# Altium schematic sheet HS-IO Outputs.SchDoc
size A3; SheetNumber: 2; SheetTotal: 3
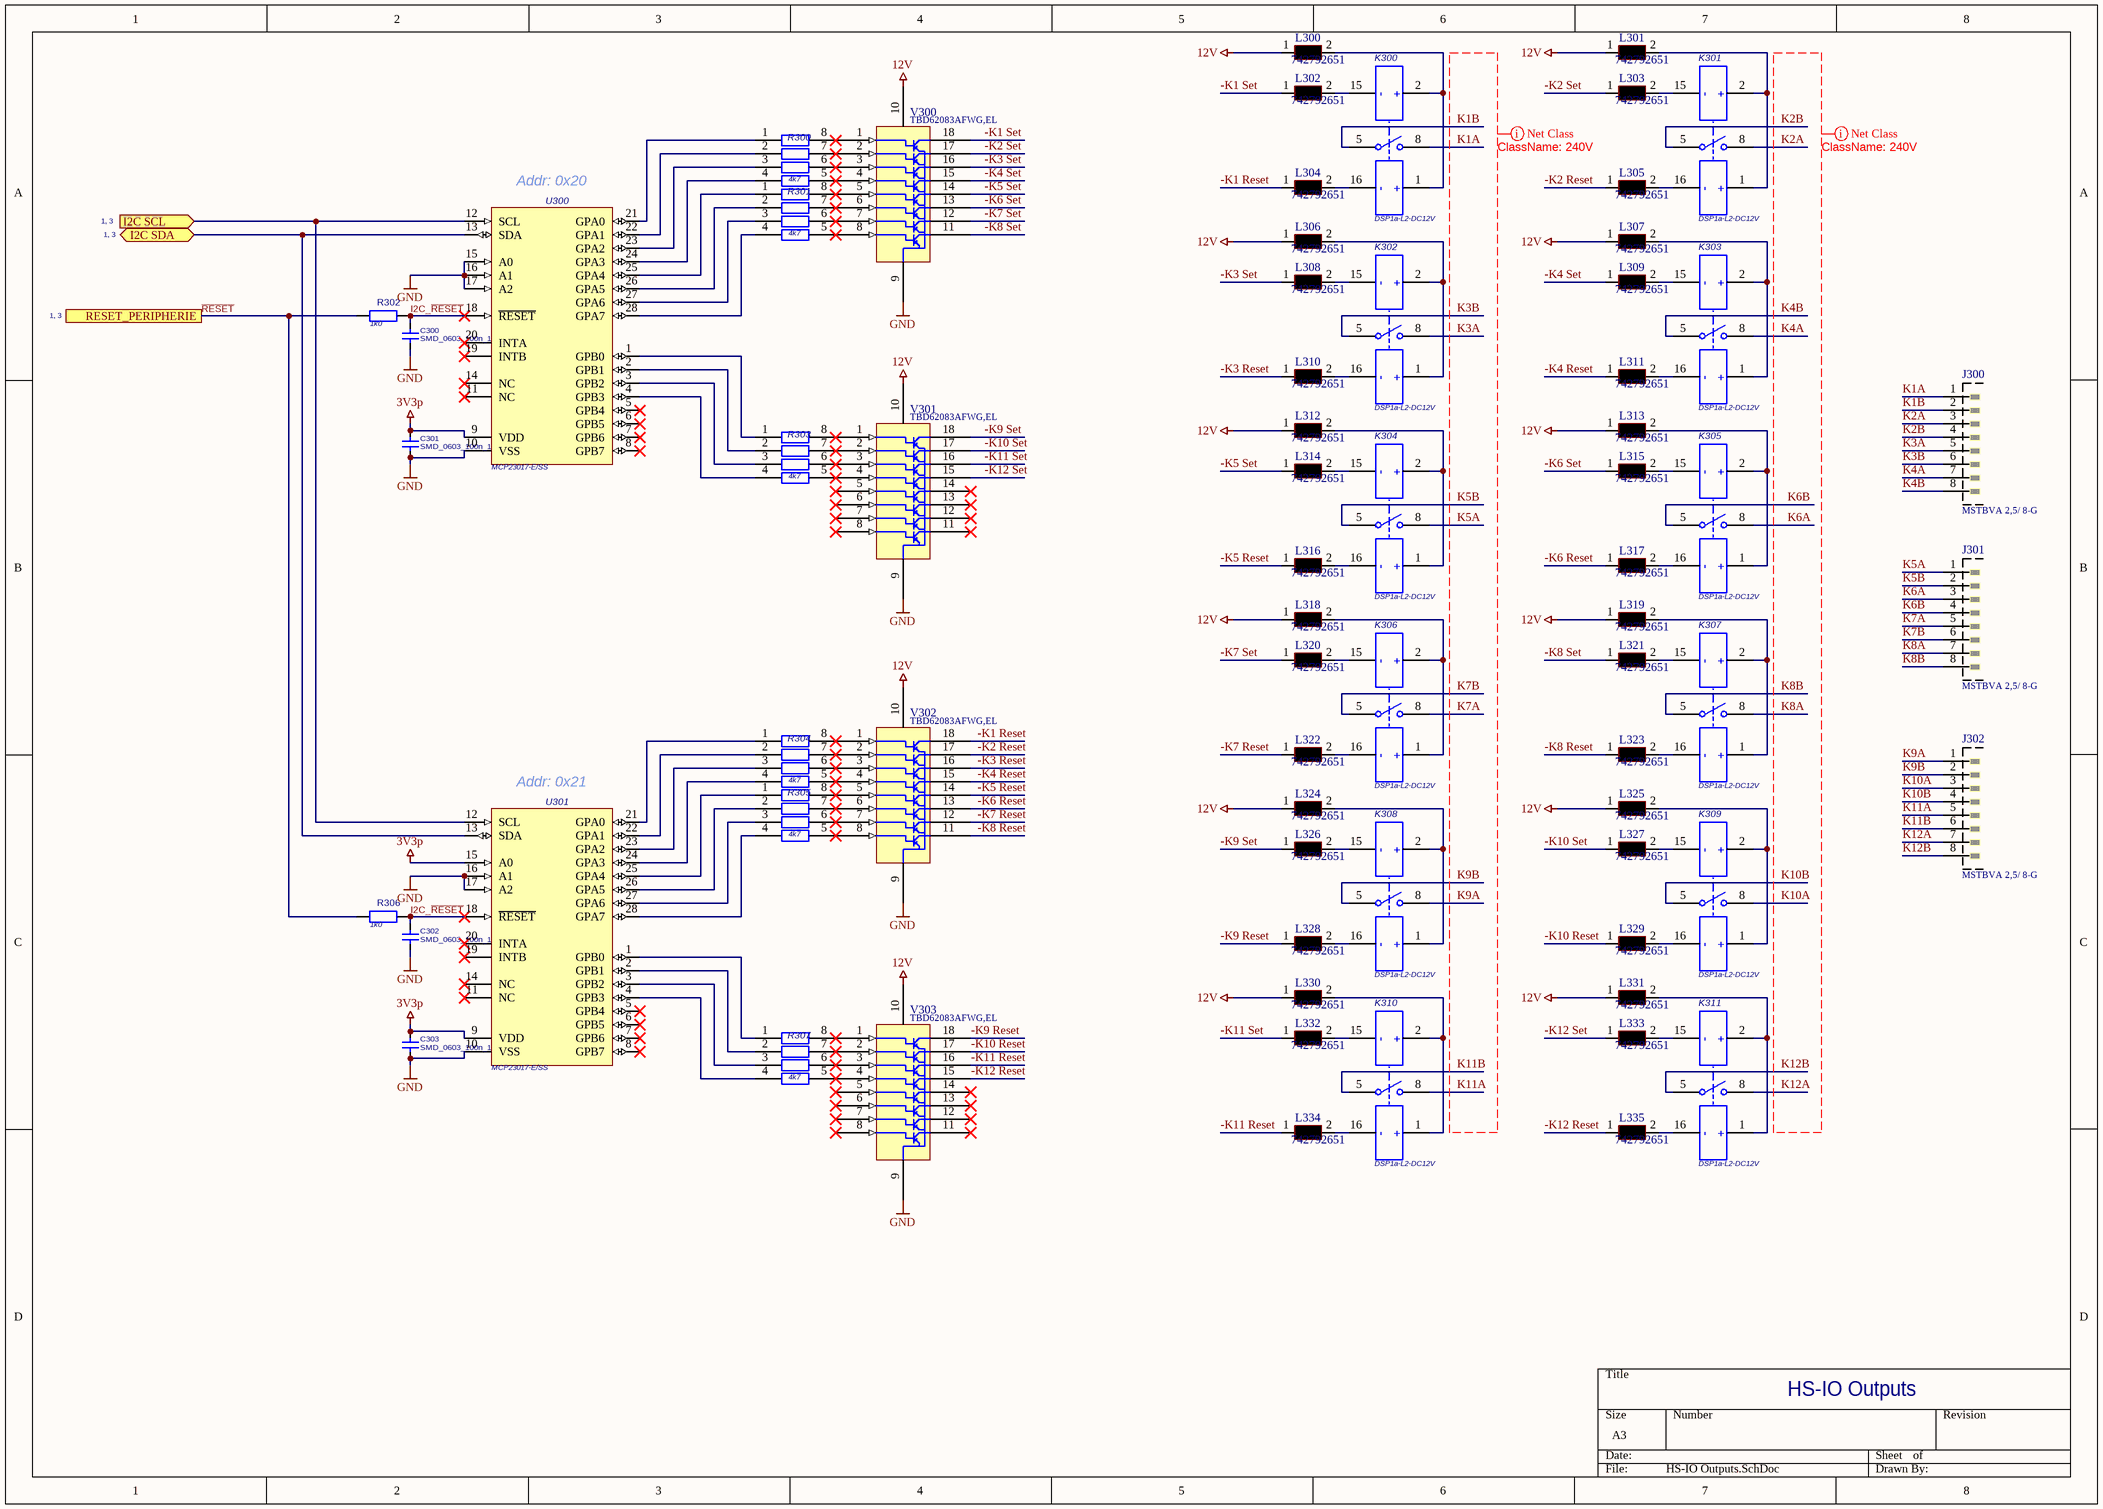
[diagram p0: HS-IO Outputs.SchDoc]

## Parts
C300  SMD_0603_100n_1  [CC1608-0603]
C301  SMD_0603_100n_1  [CC1608-0603]
C302  SMD_0603_100n_1  [CC1608-0603]
C303  SMD_0603_100n_1  [CC1608-0603]
J300  MSTBVA 2,5/ 8-G  [MSTBVA2,5/8-G - I]
J301  MSTBVA 2,5/ 8-G  [MSTBVA2,5/8-G - I]
J302  MSTBVA 2,5/ 8-G  [MSTBVA2,5/8-G - I]
K300  DSP1a-L2-DC12V  [DS-P16]
K301  DSP1a-L2-DC12V  [DS-P16]
K302  DSP1a-L2-DC12V  [DS-P16]
K303  DSP1a-L2-DC12V  [DS-P16]
K304  DSP1a-L2-DC12V  [DS-P16]
K305  DSP1a-L2-DC12V  [DS-P16]
K306  DSP1a-L2-DC12V  [DS-P16]
K307  DSP1a-L2-DC12V  [DS-P16]
K308  DSP1a-L2-DC12V  [DS-P16]
K309  DSP1a-L2-DC12V  [DS-P16]
K310  DSP1a-L2-DC12V  [DS-P16]
K311  DSP1a-L2-DC12V  [DS-P16]
L300  742792651  [0603-Ferrit]
L301  742792651  [0603-Ferrit]
L302  742792651  [0603-Ferrit]
L303  742792651  [0603-Ferrit]
L304  742792651  [0603-Ferrit]
L305  742792651  [0603-Ferrit]
L306  742792651  [0603-Ferrit]
L307  742792651  [0603-Ferrit]
L308  742792651  [0603-Ferrit]
L309  742792651  [0603-Ferrit]
L310  742792651  [0603-Ferrit]
L311  742792651  [0603-Ferrit]
L312  742792651  [0603-Ferrit]
L313  742792651  [0603-Ferrit]
L314  742792651  [0603-Ferrit]
L315  742792651  [0603-Ferrit]
L316  742792651  [0603-Ferrit]
L317  742792651  [0603-Ferrit]
L318  742792651  [0603-Ferrit]
L319  742792651  [0603-Ferrit]
L320  742792651  [0603-Ferrit]
L321  742792651  [0603-Ferrit]
L322  742792651  [0603-Ferrit]
L323  742792651  [0603-Ferrit]
L324  742792651  [0603-Ferrit]
L325  742792651  [0603-Ferrit]
L326  742792651  [0603-Ferrit]
L327  742792651  [0603-Ferrit]
L328  742792651  [0603-Ferrit]
L329  742792651  [0603-Ferrit]
L330  742792651  [0603-Ferrit]
L331  742792651  [0603-Ferrit]
L332  742792651  [0603-Ferrit]
L333  742792651  [0603-Ferrit]
L334  742792651  [0603-Ferrit]
L335  742792651  [0603-Ferrit]
R300  4k7  [ARV241]
R301  4k7  [ARV241]
R302  1k0  [CR1608-0603]
R303  4k7  [ARV241]
R304  4k7  [ARV241]
R305  4k7  [ARV241]
R306  1k0  [CR1608-0603]
R307  4k7  [ARV241]
U300  MCP23017-E/SS  [SSOP-SS28_M]
U301  MCP23017-E/SS  [SSOP-SS28_M]
V300  TBD62083AFWG,EL  [SOL-18]
V301  TBD62083AFWG,EL  [SOL-18]
V302  TBD62083AFWG,EL  [SOL-18]
V303  TBD62083AFWG,EL  [SOL-18]

## Ports
I2C SCL (in, see 1, 3), I2C SDA (bidir, see 1, 3), RESET_PERIPHERIE (see 1, 3)

## Nets
3V3p: C301.2 C303.2 U300.9(VDD) U301.9(VDD) U301.15(A0)
12V: L300.1 L301.1 L306.1 L307.1 L312.1 L313.1 L318.1 L319.1 L324.1 L325.1 L330.1 L331.1 V300.10 V301.10 V302.10 V303.10
GND: C300.1 C301.1 C302.1 C303.1 U300.10(VSS) U300.15(A0) U300.16(A1) U300.17(A2) U301.10(VSS) U301.16(A1) U301.17(A2) V300.9 V301.9 V302.9 V303.9
-K1 Reset: L304.1 V302.18
-K1 Set: L302.1 V300.18
-K2 Reset: L305.1 V302.17
-K2 Set: L303.1 V300.17
-K3 Reset: L310.1 V302.16
-K3 Set: L308.1 V300.16
-K4 Reset: L311.1 V302.15
-K4 Set: L309.1 V300.15
-K5 Reset: L316.1 V302.14
-K5 Set: L314.1 V300.14
-K6 Reset: L317.1 V302.13
-K6 Set: L315.1 V300.13
-K7 Reset: L322.1 V302.12
-K7 Set: L320.1 V300.12
-K8 Reset: L323.1 V302.11
-K8 Set: L321.1 V300.11
-K9 Reset: L328.1 V303.18
-K9 Set: L326.1 V301.18
-K10 Reset: L329.1 V303.17
-K10 Set: L327.1 V301.17
-K11 Reset: L334.1 V303.16
-K11 Set: L332.1 V301.16
-K12 Reset: L335.1 V303.15
-K12 Set: L333.1 V301.15
I2C SCL: U300.12(SCL) U301.12(SCL) ; port I2C SCL
I2C SDA: U300.13(SDA) U301.13(SDA) ; port I2C SDA
I2C_~{RESET}: C300.2 C302.2 R302.1 R306.1 U300.18(~{RESET}) U301.18(~{RESET})
K1A: J300.1 K300.8
K1B: J300.2 K300.5
K2A: J300.3 K301.8
K2B: J300.4 K301.5
K3A: J300.5 K302.8
K3B: J300.6 K302.5
K4A: J300.7 K303.8
K4B: J300.8 K303.5
K5A: J301.1 K304.8
K5B: J301.2 K304.5
K6A: J301.3 K305.8
K6B: J301.4 K305.5
K7A: J301.5 K306.8
K7B: J301.6 K306.5
K8A: J301.7 K307.8
K8B: J301.8 K307.5
K9A: J302.1 K308.8
K9B: J302.2 K308.5
K10A: J302.3 K309.8
K10B: J302.4 K309.5
K11A: J302.5 K310.8
K11B: J302.6 K310.5
K12A: J302.7 K311.8
K12B: J302.8 K311.5
~{RESET}: R302.2 R306.2 ; port RESET_PERIPHERIE
NetK300_1: K300.1(pos1) K300.2(pos2) L300.2
NetK300_15: K300.15(neg2) L302.2
NetK300_16: K300.16(neg1) L304.2
NetK301_1: K301.1(pos1) K301.2(pos2) L301.2
NetK301_15: K301.15(neg2) L303.2
NetK301_16: K301.16(neg1) L305.2
NetK302_1: K302.1(pos1) K302.2(pos2) L306.2
NetK302_15: K302.15(neg2) L308.2
NetK302_16: K302.16(neg1) L310.2
NetK303_1: K303.1(pos1) K303.2(pos2) L307.2
NetK303_15: K303.15(neg2) L309.2
NetK303_16: K303.16(neg1) L311.2
NetK304_1: K304.1(pos1) K304.2(pos2) L312.2
NetK304_15: K304.15(neg2) L314.2
NetK304_16: K304.16(neg1) L316.2
NetK305_1: K305.1(pos1) K305.2(pos2) L313.2
NetK305_15: K305.15(neg2) L315.2
NetK305_16: K305.16(neg1) L317.2
NetK306_1: K306.1(pos1) K306.2(pos2) L318.2
NetK306_15: K306.15(neg2) L320.2
NetK306_16: K306.16(neg1) L322.2
NetK307_1: K307.1(pos1) K307.2(pos2) L319.2
NetK307_15: K307.15(neg2) L321.2
NetK307_16: K307.16(neg1) L323.2
NetK308_1: K308.1(pos1) K308.2(pos2) L324.2
NetK308_15: K308.15(neg2) L326.2
NetK308_16: K308.16(neg1) L328.2
NetK309_1: K309.1(pos1) K309.2(pos2) L325.2
NetK309_15: K309.15(neg2) L327.2
NetK309_16: K309.16(neg1) L329.2
NetK310_1: K310.1(pos1) K310.2(pos2) L330.2
NetK310_15: K310.15(neg2) L332.2
NetK310_16: K310.16(neg1) L334.2
NetK311_1: K311.1(pos1) K311.2(pos2) L331.2
NetK311_15: K311.15(neg2) L333.2
NetK311_16: K311.16(neg1) L335.2
NetR300_1: R300.1 U300.21(GPA0)
NetR300_2: R300.2 U300.22(GPA1)
NetR300_3: R300.3 U300.23(GPA2)
NetR300_4: R300.4 U300.24(GPA3)
NetR300_5: R300.5 V300.4
NetR300_6: R300.6 V300.3
NetR300_7: R300.7 V300.2
NetR300_8: R300.8 V300.1
NetR301_1: R301.1 U300.25(GPA4)
NetR301_2: R301.2 U300.26(GPA5)
NetR301_3: R301.3 U300.27(GPA6)
NetR301_4: R301.4 U300.28(GPA7)
NetR301_5: R301.5 V300.8
NetR301_6: R301.6 V300.7
NetR301_7: R301.7 V300.6
NetR301_8: R301.8 V300.5
NetR303_1: R303.1 U300.1(GPB0)
NetR303_2: R303.2 U300.2(GPB1)
NetR303_3: R303.3 U300.3(GPB2)
NetR303_4: R303.4 U300.4(GPB3)
NetR303_5: R303.5 V301.4
NetR303_6: R303.6 V301.3
NetR303_7: R303.7 V301.2
NetR303_8: R303.8 V301.1
NetR304_1: R304.1 U301.21(GPA0)
NetR304_2: R304.2 U301.22(GPA1)
NetR304_3: R304.3 U301.23(GPA2)
NetR304_4: R304.4 U301.24(GPA3)
NetR304_5: R304.5 V302.4
NetR304_6: R304.6 V302.3
NetR304_7: R304.7 V302.2
NetR304_8: R304.8 V302.1
NetR305_1: R305.1 U301.25(GPA4)
NetR305_2: R305.2 U301.26(GPA5)
NetR305_3: R305.3 U301.27(GPA6)
NetR305_4: R305.4 U301.28(GPA7)
NetR305_5: R305.5 V302.8
NetR305_6: R305.6 V302.7
NetR305_7: R305.7 V302.6
NetR305_8: R305.8 V302.5
NetR307_1: R307.1 U301.1(GPB0)
NetR307_2: R307.2 U301.2(GPB1)
NetR307_3: R307.3 U301.3(GPB2)
NetR307_4: R307.4 U301.4(GPB3)
NetR307_5: R307.5 V303.4
NetR307_6: R307.6 V303.3
NetR307_7: R307.7 V303.2
NetR307_8: R307.8 V303.1

Not connected (* = marked no-connect by the designer): U300 5(GPB4)* 6(GPB5)* 7(GPB6)* 8(GPB7)* 11(NC)* 14(NC)* 19(INTB)* 20(INTA)*; U301 5(GPB4)* 6(GPB5)* 7(GPB6)* 8(GPB7)* 11(NC)* 14(NC)* 19(INTB)* 20(INTA)*; V301 5* 6* 7* 8* 11* 12* 13* 14*; V303 5* 6* 7* 8* 11* 12* 13* 14*

## Layout directives
net class 240V: K1A, K1B, K2A, K2B, K3A, K3B, K4A, K4B, K5A, K5B, K6A, K6B, K7A, K7B, K8A, K8B, K9A, K9B, K10A, K10B, K11A, K11B, K12A, K12B

## Notes on the sheet
- (near U300) Addr: 0x20
- (near U301) Addr: 0x21
- HS-IO Outputs
- (in symbol CMP-015-000010-1) -; +

## Library data of the parts
C300-C303 = CMP-018-000010-5: SMD0603, X7R, 15%, 50V, 100nF; Manufacturer: KEMET; Manufacturer Part Number: C0603C104K5RAC7867; Kommentar: Kondensator aus mehreren Keramikschichten MLCC - SMD/SMT 50V 0.1uF X7R 0603 10%; E01_Value_1: 100n; Supplier Order Number: 80-C0603C104K5R7867; Supplier Price 100pcs: 0,022 €; ComponentLink2URL: https://www.mouser.de/datasheet/2/447/KEM_C1002_X7R_SMD-3316098.pdf; Supplier: Mouser; ComponentLink1Description: Manufacturer Link; ComponentLink2Description: Datasheet; ComponentLink1URL: https://www.kemet.com
J300-J302 = CMP-019-000004-1: Phoneix Contact 8 pole connector Male RM5mm; Manufacturer: Phoenix Contact; Manufacturer Part Number: 1755574; Kommentar: Steckbare Anschlussblöcke 8 Pos 5mm pitch Through Hole Header; E01_Value_1: MSTBVA 2,5/ 8-G; ComponentLink2Description: Datasheet; Supplier Order Number: 651-1755574; ComponentLink1URL: http://www.phoenixcontact.de/; ComponentLink1Description: Manufacturer Link; Supplier Price 100pcs: 1,90 €; ComponentLink2URL: https://www.phoenixcontact.com/us/products/1755574/pdf; Supplier: Mouser
K300-K311 = CMP-015-000010-1: 8 A MINIATURE BIPOLAR POWER RELAY; ComponentLink1URL: www.panasonic.com; E01_Value_1: DSP1a-L2-DC12V; Supplier Order Number: 769-DSP1A-L2-DC12V; ComponentLink1Description: Manufacturer Link; Supplier: Mouser
L300-L335 = CMP-006-00002-1: Ferritperlen WE-CBF 0603 100MHz 600Ohm 1000mA AEC-Q200; Manufacturer: Würth; E01_Value_1: 600Ohm, 1A; ComponentLink1Description: Datasheet Link; Kommentar: Ferritperlen WE-CBF 0603 100MHz 600Ohm 1000mA AEC-Q200; Supplier Order Number: 710-742792651; ComponentLink1URL: https://www.we-online.com/components/products/datasheet/742792651.pdf; Supplier Price 100pcs: 0,157 €; Manufacturer Part Number: 742792651; Supplier: Mouser
R300 R301 R303-R305 R307 = S0603x4_NET_4k7: Widerstandsnetzwerk * 4; ComponentLink1Description: Manufacturer Link; ComponentLink2Description: Datasheet; ComponentLink2URL: c:\Entwicklungen\Datenblätter\Phicomp\73105.pdf; E01_Value_1: 4k7; Supplier: Mouser; Supplier Order Number: 652-CR0603-JW-472ELF
R302 R306 = S0603_1k0_1_1: SMD0603, 0.1W, TK100, 1%, 1,0k, Metallfilm; Manufacturer: Vishay / Dale; Manufacturer Part Number: CRCW06031K00FKEAC; Kommentar: Dickfilmwiderstände - SMD 1/10Watt 1Kohms 1% Commercial Use; ComponentLink1Description: Manufacturer Link; ComponentLink2Description: Datasheet; ComponentLink2URL: https://www.vishay.com/docs/20035/dcrcwe3.pdf; Supplier: Mouser; Supplier Order Number: 71-CRCW06031K00FKEAC; Supplier Price 100pcs: 0,007 €; E01_Value_1: 1k0; ComponentLink1URL: https://www.vishay.com/
U300 U301 = CMP-015-000011-1: 16-Bit I/O Expander with Serial Interface, 28-Pin SSOP, Extended Temperature; Manufacturer: Microchip; Kommentar: Schnittstelle - I/O-Erweiterer 16bit Input/Output Exp I2C interface; ComponentLink1URL: http://www.microchip.com/; E01_Value_1: MCP23017-E/SS; ComponentLink2Description: Datasheet; Manufacturer Part Number: MCP23017-E/SS; ComponentLink2URL: http://ww1.microchip.com/downloads/en/DeviceDoc/21952b.pdf; ComponentLink1Description: Manufacturer Link; Supplier Price 100pcs: 1,19€; Supplier Order Number: 579-MCP23017-E/SS; Supplier: Mouser
V300-V303 = CMP-031-000016-1: 8-fach Darlington Transistor Array; Manufacturer: Toshiba; Kommentar: Gate-Treiber DMOS Transistor Array 8-CH, 50V/0.5A; ComponentLink2Description: Datasheet; ComponentLink1URL: https://toshiba.semicon-storage.com; Supplier Order Number: 757-TBD62083AFWGEL; Manufacturer Part Number: TBD62083AFWG,EL; ComponentLink2URL: https://www.mouser.de/datasheet/2/408/TBD62083AFWG_datasheet_en_20160511-769679.pdf; Supplier Price 100pcs: 0,707 €; ComponentLink1Description: Manufacturer Link; E01_Value_1: TBD62083AFWG,EL; Supplier: Mouser